# EAGLE design EVmulator_T85_Compact (EAGLE 9.6.2)
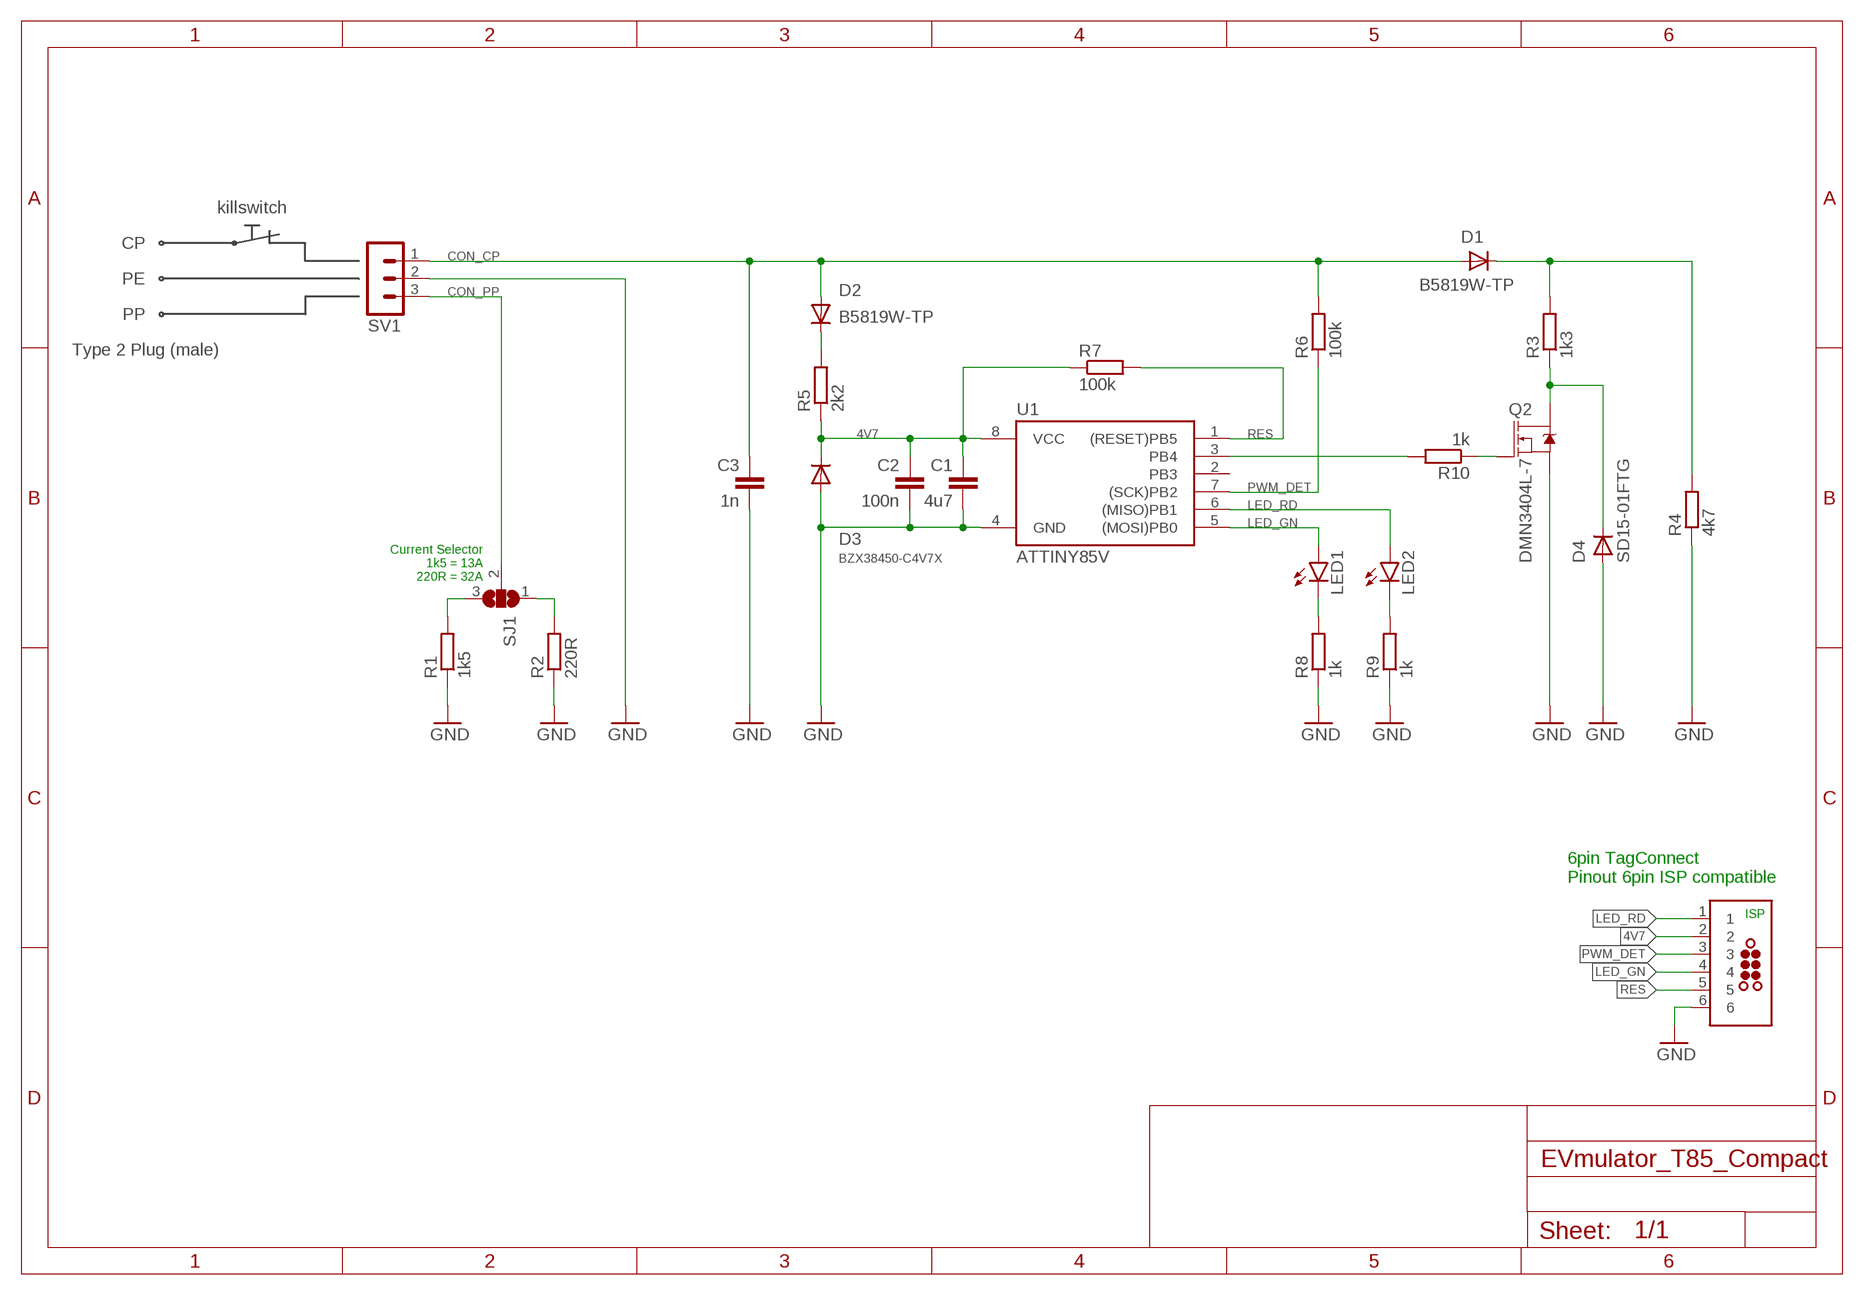
[diagram p0: schematic, sheet 1]

## Parts
C1  4u7  C-EUC0603  [C0603]
C2  100n  C-EUC0603  [C0603]
C3  1n  C-EUC0603  [C0603]
D1  B5819W-TP  DIODESOD-123  [SOD-123]
D2  B5819W-TP  DIODESOD-123  [SOD-123]
D3  BZX38450-C4V7X  DIODESOD-323F  [SOD-323F]
D4  SD15-01FTG  DIODESOD-323F  [SOD-323F]
J1  TAG-CONNECT_TC2030-MCP-NL  [TAG-CONNECT_TC2030-MCP-NL]
LED1  LEDCHIP-LED0603  [CHIP-LED0603]
LED2  LEDCHIP-LED0603  [CHIP-LED0603]
Q2  DMN3404L-7  MOSFET-NCH-AO3404A  [SOT23-3]
R1  1k5  R-EU_R0805  [R0805]
R2  220R  R-EU_R0805  [R0805]
R3  1k3  R-EU_R0603  [R0603]
R4  4k7  R-EU_R0603  [R0603]
R5  2k2  R-EU_R0603  [R0603]
R6  100k  R-EU_R0603  [R0603]
R7  100k  R-EU_R0603  [R0603]
R8  1k  R-EU_R0603  [R0603]
R9  1k  R-EU_R0603  [R0603]
R10  1k  R-EU_R0603  [R0603]
SJ1  SJ2W  [SJ_2]
SV1  MA03-1  [MA03-1]
U1  ATTINY85V  ATTINY25/45/85-20SU  [SOIC8]

## Nets
4V7: C1.1 C2.1 D3.C J1.2 R5.1 R7.1 U1.8(VCC)
CON_CP: C3.1 D1.A D2.A R6.2 SV1.1
CON_PP: SJ1.2 SV1.3
GND: C1.2 C2.2 C3.2 D3.A D4.A J1.6 Q2.2(S) R1.1 R2.1 R4.1 R8.1 R9.1 SV1.2 U1.4(GND)
LED_GN: J1.4 LED1.A U1.5((MOSI)PB0)
LED_RD: J1.1 LED2.A U1.6((MISO)PB1)
N$1: R1.2 SJ1.3
N$2: R2.2 SJ1.1
N$3: LED1.C R8.2
N$4: LED2.C R9.2
N$5: D4.C Q2.3(D) R3.1
N$6: D1.C R3.2 R4.2
N$7: D2.C R5.2
N$8: Q2.1(G) R10.1
N$10: R10.2 U1.3(PB4)
PWM_DET: J1.3 R6.1 U1.7((SCK)PB2)
RES: J1.5 R7.2 U1.1((RESET)PB5)
Unconnected: U1.2(PB3)

## Notes on the sheet
- killswitch
- CP
- PE
- PP
- Type 2 Plug (male)
- Current Selector
  1k5 = 13A
  220R = 32A
- 6pin TagConnect
  Pinout 6pin ISP compatible
- ISP

## Library data of the parts
C1-C3 = rcl:C-EU: CAPACITOR, European symbol; SPICEPREFIX: C
D1-D4 = adafruit:DIODE: Diode SMADIODE - SMA Surface Mount Package 20V 1A Schottky Diode Digikey: 641-1014-6-ND DO-1N4148 - Through Hole Small Current Diode SOD-123 20V 1 A (.5mV Vf) Schottky Diode - Digikey: MBRX120TPMSCT-ND SOD-323 10V 570mA (.38mV Vf, 3ns) Schottky Diode - Digikey: ZLLS410CT-ND SOD-523 30V 30mA Schottky Diode (RB751S-40TE61) - Digikey: RB751S-40TE61CT-ND SOT23-R/W - SOT23 Package (R = Solder Paste/Reflow Ovens, W = Hand-Soldering) BAT54Film 40V 300mA - Digikey: 497-7162-1-ND
J1 = Eigene-Rietig:TAG-CONNECT_TC2030: TAG-CONNECT ICSP Connector Manufacturer: Tag-Connect <http://www.tag-connect.com> Cable for easy In-Circuit Serial Programming. Designed for Microchip ICD2, suitable for many others. Two variants - one "with legs" (for hands-free fit on PCB) and another "without legs" for quick programming. PAD Description 1 MCLR/Vpp 2 Vdd 3 GND 4 PGD (ISPDAT) 5 PGC (ISPCLK) 6 nc (used for LVP) ©2009 ROFA.cz - modified and updated by Robert Darlington ‹rdarlington@gmail.com›
LED1 LED2 = led:LED: LED OSRAM: - CHIPLED LG R971, LG N971, LY N971, LG Q971, LY Q971, LO R971, LY R971 LH N974, LH R974 LS Q976, LO Q976, LY Q976 LO Q996 - Hyper CHIPLED LW Q18S LB Q993, LB Q99A, LB R99A - SideLED LS A670, LO A670, LY A670, LG A670, LP A670 LB A673, LV A673, LT A673, LW A673 LH A674 LY A675 LS A676, LA A676, LO A676, LY A676, LW A676 LS A679, LY A679, LG A679 - Hyper Micro SIDELED® LS Y876, LA Y876, LO Y876, LY Y876 LT Y87S - SmartLED LW L88C, LW L88S LB L89C, LB L89S, LG L890 LS L89K, LO L89K, LY L89K LS L896, LA L896, LO L896, LY L896 - TOPLED LS T670, LO T670, LY T670, LG T670, LP T670 LSG T670, LSP T670, LSY T670, LOP T670, LYG T670 LG T671, LOG T671, LSG T671 LB T673, LV T673, LT T673, LW T673 LH T674 LS T676, LA T676, LO T676, LY T676, LB T676, LH T676, LSB T676, LW T676 LB T67C, LV T67C, LT T67C, LS T67K, LO T67K, LY T67K, LW E67C LS E67B, LA E67B, LO E67B, LY E67B, LB E67C, LV E67C, LT E67C LW T67C LS T679, LY T679, LG T679 LS T770, LO T770, LY T770, LG T770, LP T770 LB T773, LV T773, LT T773, LW T773 LH T774 LS E675, LA E675, LY E675, LS T675 LS T776, LA T776, LO T776, LY T776, LB T776 LHGB T686 LT T68C, LB T68C - Hyper Mini TOPLED® LB M676 - Mini TOPLED Santana® LG M470 LS M47K, LO M47K, LY M47K Source: http://www.osram.convergy.de LUXEON: - LUMILED® LXK2-PW12-R00, LXK2-PW12-S00, LXK2-PW14-U00, LXK2-PW14-V00 LXK2-PM12-R00, LXK2-PM12-S00, LXK2-PM14-U00 LXK2-PE12-Q00, LXK2-PE12-R00, LXK2-PE12-S00, LXK2-PE14-T00, LXK2-PE14-U00 LXK2-PB12-K00, LXK2-PB12-L00, LXK2-PB12-M00, LXK2-PB14-N00, LXK2-PB14-P00, LXK2-PB14-Q00 LXK2-PR12-L00, LXK2-PR12-M00, LXK2-PR14-Q00, LXK2-PR14-R00 LXK2-PD12-Q00, LXK2-PD12-R00, LXK2-PD12-S00 LXK2-PH12-R00, LXK2-PH12-S00 LXK2-PL12-P00, LXK2-PL12-Q00, LXK2-PL12-R00 Source: www.luxeon.com KINGBRIGHT: KA-3528ASYC Source: www.kingbright.com
Q2 = SparkFun-DiscreteSemi:MOSFET-NCH: N-channel MOSFETs Voltage controlled devices that allow control of high current outputs. SparkFun Products: SparkFun OpenScale <https://www.sparkfun.com/products/13261> SparkFun Digital Sandbox <https://www.sparkfun.com/products/12651> SparkFun Monster Moto Shield <https://www.sparkfun.com/products/10182> SparkFun MOSFET Power Controller <https://www.sparkfun.com/products/11214>; PROD_ID: TRANS-12988; VALUE: 5.8A/30V/35mΩ
R1-R10 = rcl:R-EU_: RESISTOR, European symbol; SPICEPREFIX: R
SJ1 = jumper:SJ2W: SMD solder JUMPER
SV1 = con-lstb:MA03-1: PIN HEADER; OC_FARNELL: unknown; OC_NEWARK: unknown
U1 = Eigene-Rietig:ATTINY25/45/85

## Board
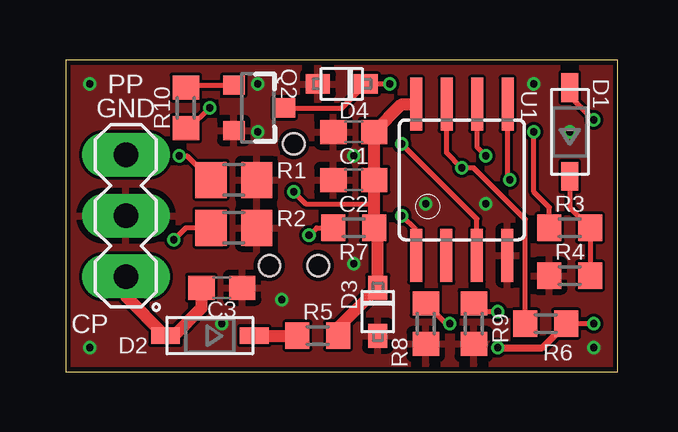
[diagram p1: board, top side]
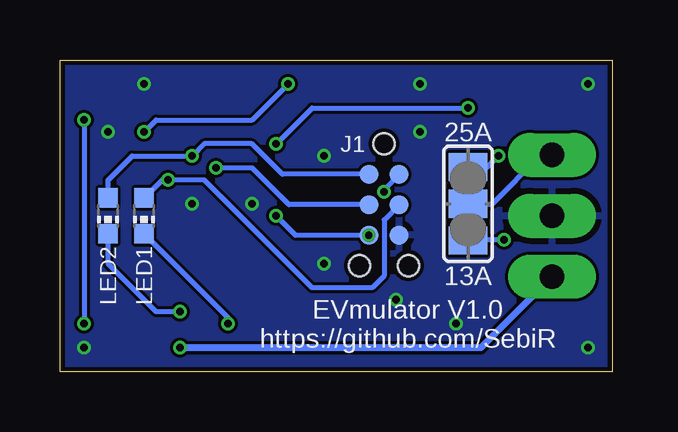
[diagram p2: board, bottom side, seen from below]

Size 23 x 13 mm. Coordinates in mm from the lower left corner, seen from the top.
Outline: 0,0 23,0 23,13 0,13 0,0
Copper layers (1*16): Top 0.035mm / dielectric 1.6mm / Bottom 0.035mm
Design rules "jlcpcb-2layers": minimum track width 0.2mm, minimum drill 0.3mm, track to track 5mil, track to pad 5mil, pad to pad 5mil, via to via 5mil, smd to smd 5mil, copper to edge 0.2mm, drill to drill 6mil, minimum pad ring 10mil, minimum via ring 0.125mm, stop-mask expansion 4mil, vias tented up to drill 0.5mm, thermal gap 10mil

### Footprints (pad centres in the part's own frame; a part is rotated, then mirrored left to right if it is on the bottom)
C0603 = smd 1.1 x 1: 1 -0.85,0; 2 0.85,0
SOD-123 = smd 1.2 x 0.7: A 1.85,0; C -1.85,0
SOD-323F = smd 1 x 0.8: A -1,0; C 1,0
TAG-CONNECT_TC2030-MCP-NL = smd 0.787 x 0.787: 1 1.27,-0.635; 2 1.27,0.635; 3 2.54,-0.635; 4 2.54,0.635; 5 3.81,-0.635; 6 3.81,0.635 | hole 0.889: 0,0; 5.08,-1.016; 5.08,1.016
CHIP-LED0603 = smd 0.8 x 0.8: A 0,-0.75; C 0,0.75
SOT23-3 = smd 0.8 x 0.9: 1 -0.95,-1; 2 0.95,-1; 3 0,1.1
R0805 = smd 1.3 x 1.5: 1 -0.95,0; 2 0.95,0
R0603 = smd 1 x 1.1: 1 -0.85,0; 2 0.85,0
SJ_2 = smd 1.168 x 1.6: 1 -1.524,0; 2 0,0; 3 1.524,0
MA03-1 = drill 1.016 long: 1 -2.54,0; 2 0,0; 3 2.54,0
SOIC8 = smd 0.5 x 2.2: 1 -1.905,-3.154; 2 -0.645,-3.154; 3 0.625,-3.154; 4 1.895,-3.154; 5 1.905,3.154; 6 0.635,3.154; 7 -0.635,3.154; 8 -1.905,3.154

### Placement (x,y rotation side)
C1  12,10 180 top
C2  12,8 180 top
C3  6.5,3.5 0 top
D1  21,10 90 top
D2  6,1.5 180 top
D3  13,2.5 90 top
D4  11.5,12 0 top
J1  9.5,9.5 270 bottom
LED1  19.5,6.5 180 bottom
LED2  21,6.5 180 bottom
Q2  8,11 270 top
R1  7,8 180 top
R2  7,6 180 top
R3  21,6 0 top
R4  21,4 0 top
R5  10.5,1.5 180 top
R6  20,2 0 top
R7  12,6 180 top
R8  15,2 90 top
R9  17,2 90 top
R10  5,11 270 top
SJ1  6,7 90 bottom
SV1  2.5,6.5 90 top
U1  16.5,8 0 top

### Tracks (layer width: path | path; a pad name or v marks a point on that pad's centre or on a via)
4V7  (via drill 0.3)
  Top 0.2: v9.5,7.5 10,7 12.85,7
  Top 0.5: U1.8 14,11.15 C1.1 C2.1 12.85,7 R7.1 13,5.85 D3.C 11.35,1.85 R5.1
  Bottom 0.2: J1.2 9.5,7.59 v9.5,7.5
CON_CP  (via drill 0.3)
  Top 0.2: D1.A 21,11.5 v22,10.5 | v22,2 R6.2
  Top 0.3: v18,1 19.85,1 R6.2
  Top 0.5: SV1.1 2.5,3.15 D2.A 4.5,1.5 5.65,2.65 C3.1
  Bottom 0.2: v22,10.5 v22,2
  Bottom 0.3: SV1.1 5.46,1 v18,1
CON_PP
  Bottom 0.2: SJ1.2 5,7 2.96,9.04 SV1.3
GND  (via drill 0.3)
  other vias: 9,3 17.5,7 22,1 19.5,12 21,10 8,12 8,10 1,12 1,1 12,4.5 12,9 6.5,2 15,7
  pour Top: 0,13 23,13 23,0 0,0
  pour Bottom: 0,13 23,13 23,0 0,0
LED_GN  (via drill 0.3)
  Top 0.2: v18.5,8 18.41,8.1 U1.5
  Bottom 0.2: LED1.A 18.75,8 v18.5,8 17,8 12.5,3.5 10,3.5 9.5,4 9.5,6.33 J1.4
LED_RD  (via drill 0.3)
  Top 0.2: v17.5,9 17.14,9.37 U1.6
  Bottom 0.2: J1.1 13.73,8.23 15,9.5 17,9.5 v17.5,9 20,9 21,8 LED2.A
N$1  (via drill 0.3)
  Top 0.2: 5.73,8 R1.2 5.05,9 v4.73,9
  Bottom 0.2: SJ1.3 5.21,8.52 v4.73,9
N$2  (via drill 0.3)
  Top 0.2: R2.2 5,6 v4.5,5.5
  Bottom 0.2: v4.5,5.5 5.98,5.5 SJ1.1
N$3  (via drill 0.3)
  Top 0.2: v16,2 15.85,2 R8.2
  Bottom 0.2: LED1.C 16,2.25 v16,2
N$4  (via drill 0.3)
  Top 0.2: 17.15,2.85 R9.2 17.35,2.5 v18,2.5
  Bottom 0.2: v18,2.5 19,2.5 21,4.5 LED2.C
N$5  (via drill 0.3)
  Top 0.2: Q2.3 11.5,11 D4.C v13.5,12 | R3.1 20.15,6.85 19.5,7.5 v19.5,10
  Bottom 0.2: v19.5,10 19,10.5 15,10.5 v13.5,12
N$6
  Top 0.2: D1.C 21,6.85 R3.2 R4.2
N$7
  Top 0.5: D2.C R5.2
N$8
  Top 0.2: R10.1 5.1,11.95 Q2.1
N$10  (via drill 0.3)
  Top 0.2: U1.3 17.12,6.38 v14,9.5 | v6,11 5.15,10.15 R10.2
  Bottom 0.2: v14,9.5 12.5,11 v6,11
PWM_DET  (via drill 0.3)
  Top 0.2: U1.7 15.87,9.13 v16.5,8.5 17,8.5 19.15,6.35 R6.1
  Bottom 0.2: J1.3 13.46,6.96 15,8.5 v16.5,8.5
RES  (via drill 0.3)
  Top 0.2: J1.5 10.45,6 R7.2 | U1.1 14.6,5.91 v14,6.5
  Bottom 0.2: v14,6.5 13.19,5.69 J1.5
  other vias: 10.13,5.69

### Text on the board
tPlace: PP | GND | CP
bPlace: 25A | 13A | EVmulator V1.0 / https://github.com/SebiR